# EAGLE design untitled (EAGLE 6.5.0)
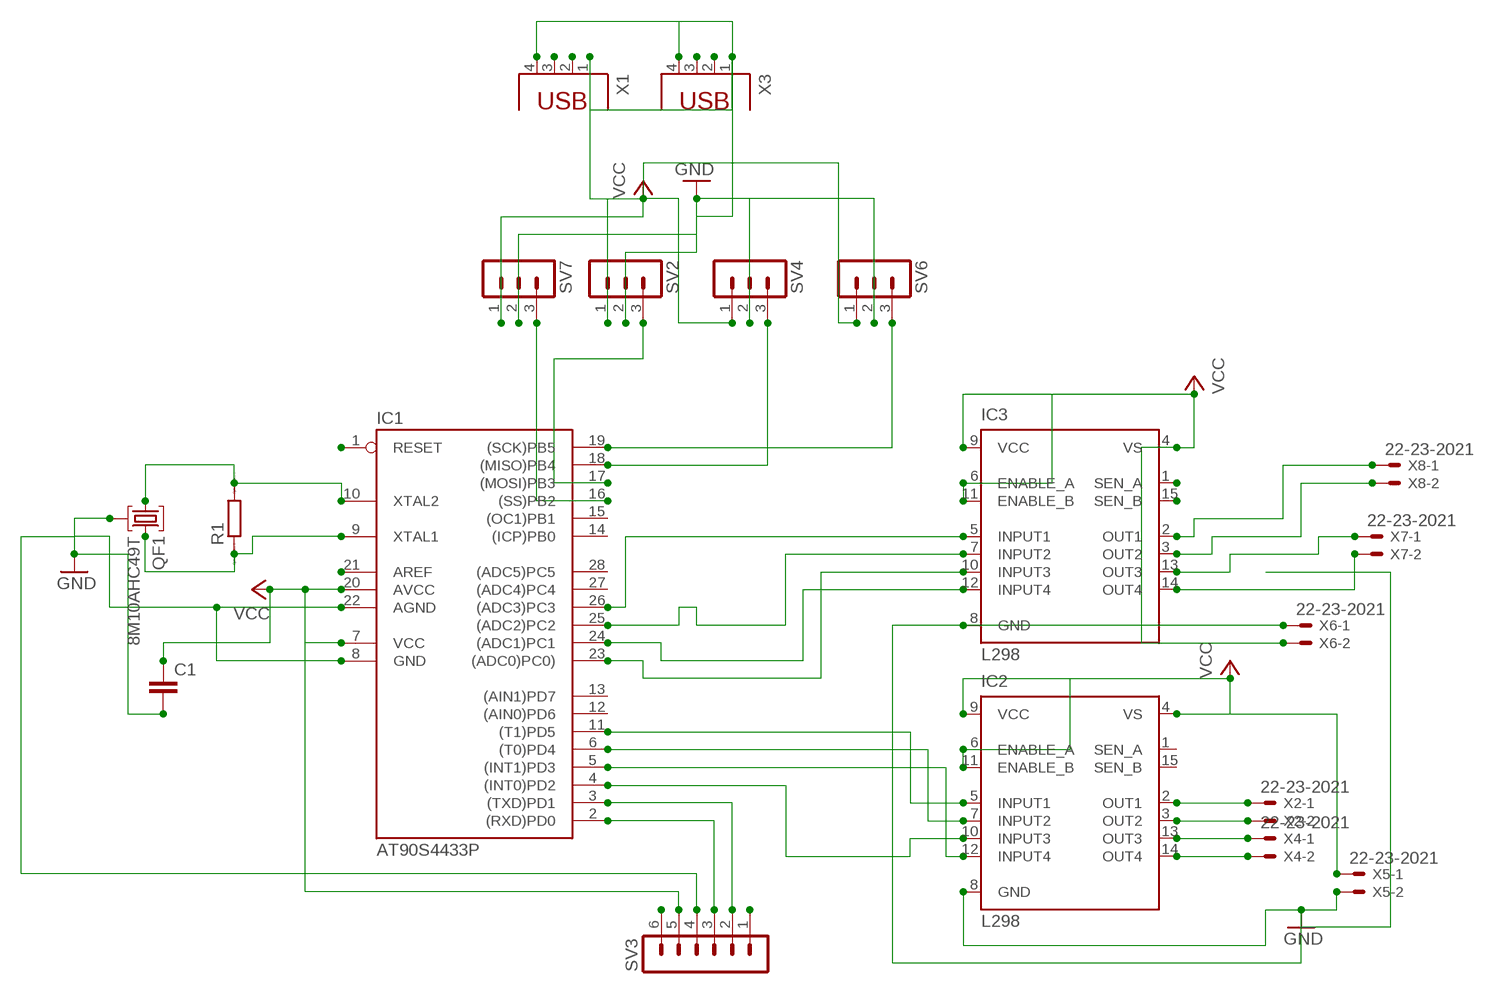
[diagram p0: schematic, sheet 1]

## Parts
C1  C2,5-3  [C2.5-3]
IC1  AT90S4433P  [DIL28-3]
IC2  L298  [MULTIWATT-15]
IC3  L298  [MULTIWATT-15]
QF1  8M10AHC49T  [HC49U]
R1  R0207/10  [0207/10]
SV2  MA03-1  [MA03-1]
SV3  MA06-1  [MA06-1]
SV4  MA03-1  [MA03-1]
SV6  MA03-1  [MA03-1]
SV7  MA03-1  [MA03-1]
X1  PN61729  [PN61729]
X2  22-23-2021  [22-23-2021]
X3  PN61729  [PN61729]
X4  22-23-2021  [22-23-2021]
X5  22-23-2021  [22-23-2021]
X6  22-23-2021  [22-23-2021]
X7  22-23-2021  [22-23-2021]
X8  22-23-2021  [22-23-2021]

## Nets
GND: C1.2 IC1.8(GND) IC1.22(AGND) IC2.8(GND) IC3.8(GND) QF1.2 SV2.2 SV3.4 SV4.2 SV6.2 SV7.2 X1.4 X3.4 X5.2 X6.1
N$1: IC1.10(XTAL2) QF1.1 R1.2
N$2: IC1.18((MISO)PB4) SV4.3
N$4: IC1.23((ADC0)PC0)) IC3.10(INPUT3)
N$5: IC1.1(RESET)
N$6: IC1.16((SS)PB2) SV7.3
N$7: IC1.9(XTAL1) QF1.3 R1.1
N$8: IC1.21(AREF)
N$9: IC1.17((MOSI)PB3) SV2.3
N$10: IC2.2(OUT1) X2.1
N$11: IC1.26((ADC3)PC3) IC3.5(INPUT1)
N$12: X1.2
N$13: IC1.19((SCK)PB5) SV6.3
N$14: X1.3
N$15: IC1.24((ADC1)PC1) IC3.12(INPUT4)
N$16: IC2.3(OUT2) X2.2
N$17: IC1.25((ADC2)PC2) IC3.7(INPUT2)
N$18: IC2.13(OUT3) X4.1
N$19: IC2.14(OUT4) X4.2
N$20: IC1.4((INT0)PD2) IC2.10(INPUT3)
N$27: IC1.11((T1)PD5) IC2.5(INPUT1)
N$28: IC1.6((T0)PD4) IC2.7(INPUT2)
N$29: IC1.5((INT1)PD3) IC2.12(INPUT4)
N$30: IC3.2(OUT1) X8.1
N$31: IC3.3(OUT2) X8.2
N$32: IC3.13(OUT3) X7.1
N$33: IC3.14(OUT4) X7.2
N$41: SV3.6
N$44: IC1.2((RXD)PD0) SV3.3
N$45: IC1.3((TXD)PD1) SV3.2
N$46: SV3.1
N$49: X3.3
N$50: X3.2
N$54: IC3.1(SEN_A)
N$55: IC3.15(SEN_B)
VCC: C1.1 IC1.7(VCC) IC1.20(AVCC) IC2.4(VS) IC2.6(ENABLE_A) IC2.9(VCC) IC2.11(ENABLE_B) IC3.4(VS) IC3.6(ENABLE_A) IC3.9(VCC) IC3.11(ENABLE_B) SV2.1 SV3.5 SV4.1 SV6.1 SV7.1 X1.1 X3.1 X5.1 X6.2
Unconnected: IC1.12((AIN0)PD6) IC1.13((AIN1)PD7) IC1.14((ICP)PB0) IC1.15((OC1)PB1) IC1.27((ADC4)PC4) IC1.28((ADC5)PC5) IC2.1(SEN_A) IC2.15(SEN_B)

## Library data of the parts
C1 = capacitor-wima:C: CAPACITOR naming: grid - package width
IC1 = atmel:AT90S4433: MICROCONTROLLER 4 Kbytes FLASH 128 bytes SRAM 256 bytes EEPROM UART 6-channel 10 bit ADC; OC_FARNELL: unknown; OC_NEWARK: unknown
IC2 IC3 = st-microelectronics:L298: DUAL FULL-BRIDGE DRIVER; MPN: L298N; OC_FARNELL: 1589425; OC_NEWARK: 32M1527
QF1 = crystal:8M10AHC49T: Monolithic Crystal Filters Source: www.vanlong.com; OC_FARNELL: unknown; OC_NEWARK: unknown
R1 = eagle-ltspice:R: RESISTOR, European symbol; SPICEMODEL: NONE; SPICEPREFIX: R
SV2 SV4 SV6 SV7 = con-lstb:MA03-1: PIN HEADER; OC_FARNELL: unknown; OC_NEWARK: unknown
SV3 = con-lstb:MA06-1: PIN HEADER; OC_FARNELL: unknown; OC_NEWARK: unknown
X1 X3 = con-berg:PN61729: BERG USB connector; OC_FARNELL: unknown; OC_NEWARK: unknown
X2 X4-X8 = con-molex:22-23-2021: .100" (2.54mm) Center Header - 2 Pin; MF: MOLEX; MPN: 22-23-2021; OC_FARNELL: 1462926; OC_NEWARK: 25C3832

## Board
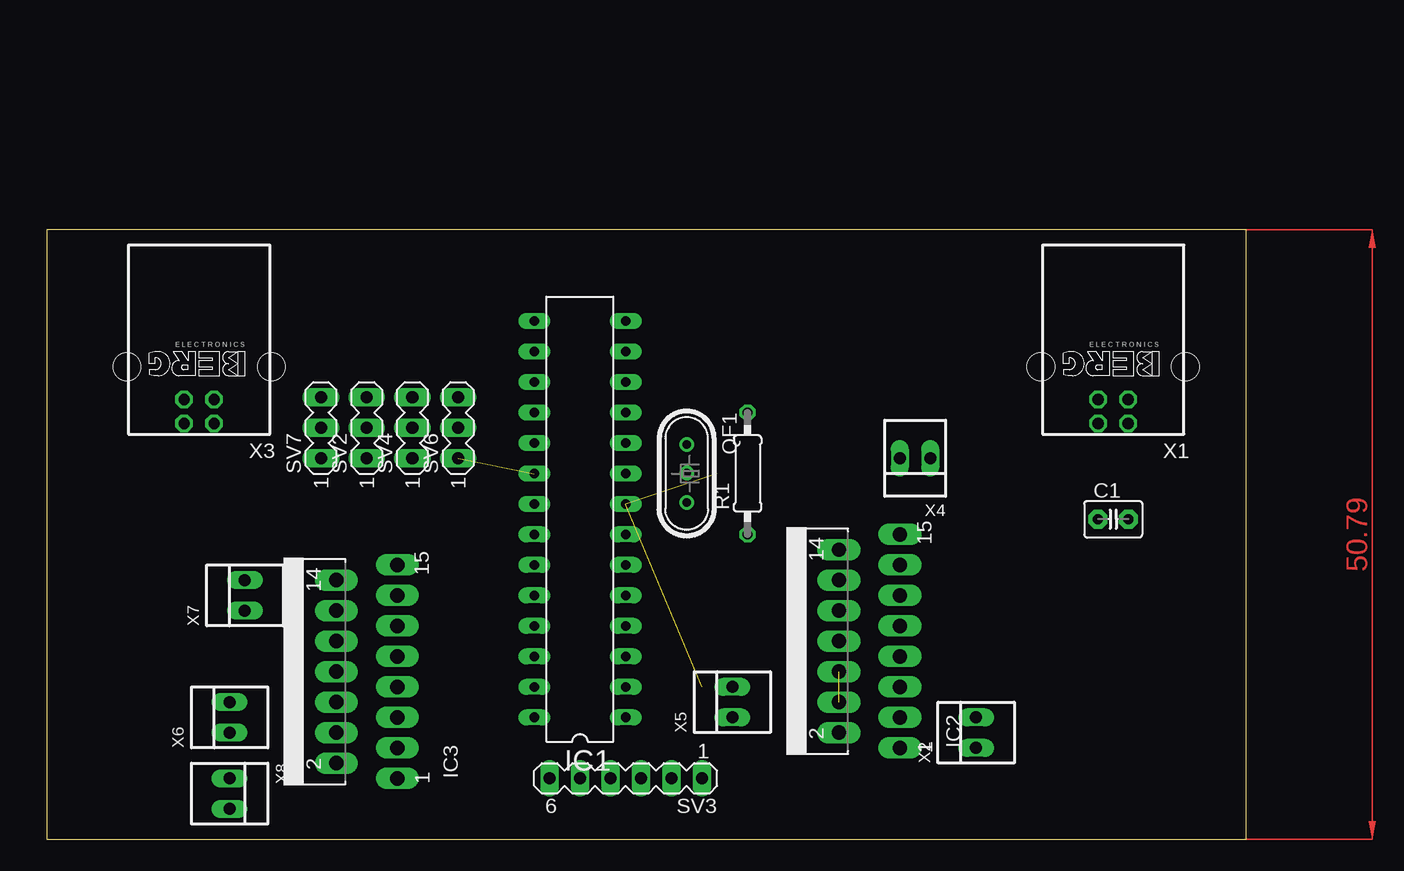
[diagram p1: board, top side]
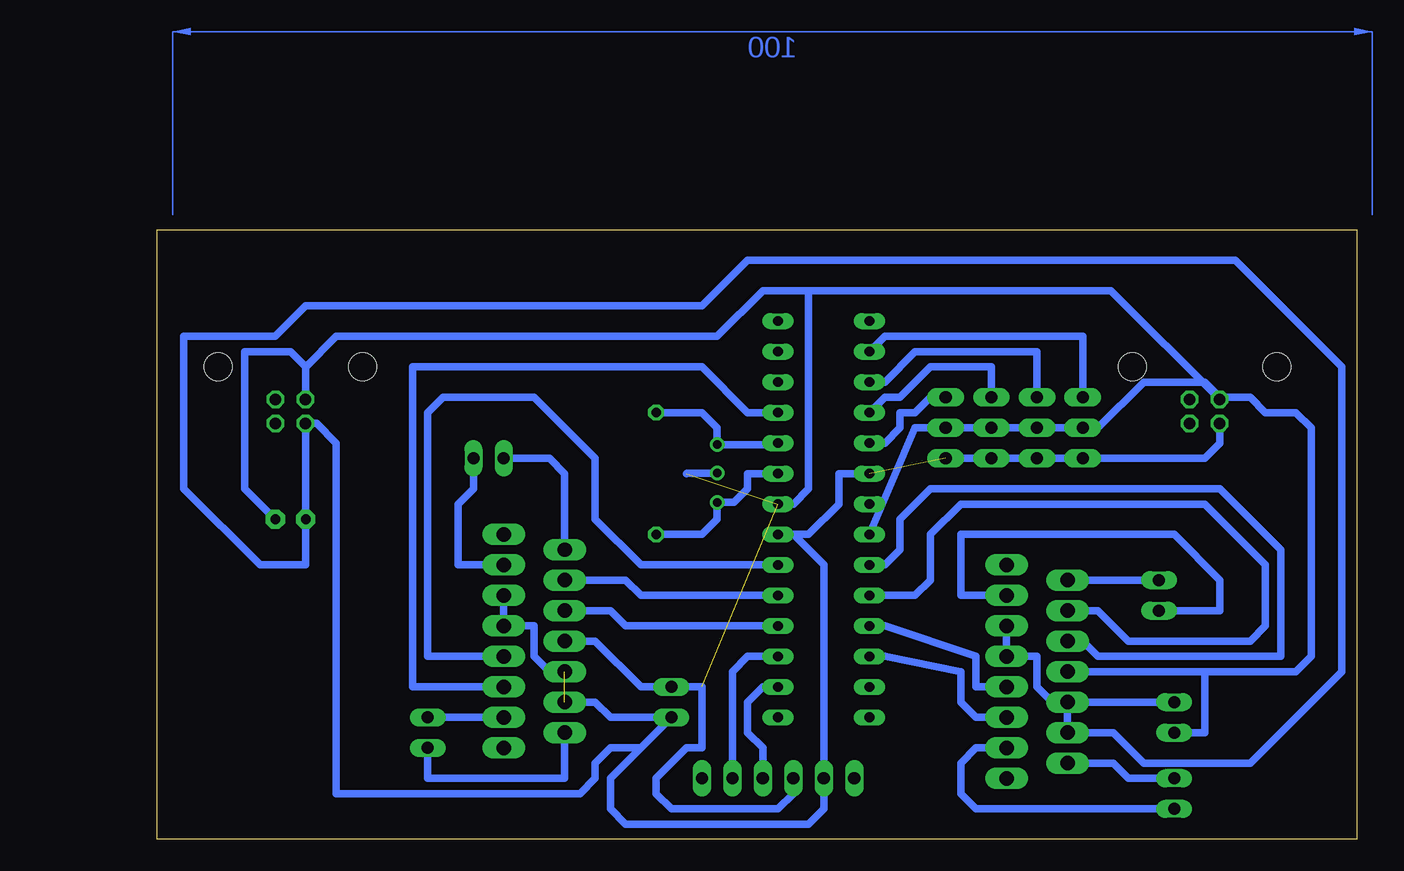
[diagram p2: board, bottom side, seen from below]

Size 100 x 50.79 mm. Coordinates in mm from the lower left corner, seen from the top.
Outline: 0,0 100,0 100,50.79 0,50.79 0,0
Copper layers (1*16): Top 0.035mm / dielectric 1.5mm / Bottom 0.035mm
Design rules "default": minimum track width 10mil, minimum drill 24mil, track to track 8mil, track to pad 8mil, pad to pad 8mil, via to via 8mil, smd to smd 8mil, copper to edge 40mil, drill to drill 8mil, minimum pad ring 10mil, minimum via ring 8mil, stop-mask expansion 4mil, vias tented up to drill 0mil, thermal gap 10mil

### Footprints (pad centres in the part's own frame; a part is rotated, then mirrored left to right if it is on the bottom)
C2.5-3 = drill 0.813 pad 1.6 octagon: 1 -1.27,0; 2 1.27,0
DIL28-3 = drill 0.813 long: 1 -16.51,-3.81; 2 -13.97,-3.81; 3 -11.43,-3.81; 4 -8.89,-3.81; 5 -6.35,-3.81; 6 -3.81,-3.81; 7 -1.27,-3.81; 8 1.27,-3.81; 9 3.81,-3.81; 10 6.35,-3.81; 11 8.89,-3.81; 12 11.43,-3.81; 13 13.97,-3.81; 14 16.51,-3.81; 15 16.51,3.81; 16 13.97,3.81; 17 11.43,3.81; 18 8.89,3.81; 19 6.35,3.81; 20 3.81,3.81; 21 1.27,3.81; 22 -1.27,3.81; 23 -3.81,3.81; 24 -6.35,3.81; 25 -8.89,3.81; 26 -11.43,3.81; 27 -13.97,3.81; 28 -16.51,3.81
MULTIWATT-15 = drill 1.2 long: 1 -8.89,-7.62; 2 -7.62,-2.54; 3 -6.35,-7.62; 4 -5.08,-2.54; 5 -3.81,-7.62; 6 -2.54,-2.54; 7 -1.27,-7.62; 8 0,-2.54; 9 1.27,-7.62; 10 2.54,-2.54; 11 3.81,-7.62; 12 5.08,-2.54; 13 6.35,-7.62; 14 7.62,-2.54; 15 8.89,-7.62
HC49U = drill 0.7 pad 1.2: 1 -2.413,0; 2 -0.027,0; 3 2.413,0
0207/10 = drill 0.813 octagon: 1 -5.08,0; 2 5.08,0
MA03-1 = drill 1.016 long: 1 -2.54,0; 2 0,0; 3 2.54,0
MA06-1 = drill 1.016 long: 1 -6.35,0; 2 -3.81,0; 3 -1.27,0; 4 1.27,0; 5 3.81,0; 6 6.35,0
PN61729 = drill 0.95 octagon: 1 1.25,4.71; 2 -1.25,4.71; 3 -1.25,2.71; 4 1.25,2.71 | hole 2.3: -6.02,0; 6.02,0
22-23-2021 = drill 1 long: 1 -1.27,0; 2 1.27,0

### Placement (x,y rotation side)
C1  88.9,26.67 0 top
IC1  44.45,26.67 90 top
IC2  63.5,16.51 90 top
IC3  21.59,13.97 90 top
QF1  53.34,30.48 270 top
R1  58.42,30.48 90 top
SV2  26.67,34.29 90 top
SV3  48.26,5.08 180 top
SV4  30.48,34.29 90 top
SV6  34.29,34.29 90 top
SV7  22.86,34.29 90 top
X1  88.9,39.37 180 top
X2  77.47,8.89 90 top
X3  12.7,39.37 180 top
X4  72.39,31.75 180 top
X5  57.15,11.43 90 top
X6  15.24,10.16 90 top
X7  16.51,20.32 90 top
X8  15.24,3.81 270 top

### Tracks (layer width: path | path; a pad name or v marks a point on that pad's centre or on a via)
GND  (2 unrouted)
  Bottom 0.61: IC1.22 36.83,34.29 SV6.2 SV4.2 SV2.2 SV7.2 21.59,34.29 17.78,38.1 12.7,38.1 11.45,36.85 X3.4 | IC2.8 63.5,16.51 59.69,12.7 X5.2 54.61,12.7 54.61,7.62 55.88,7.62 58.42,5.08 58.42,3.81 57.15,2.54 48.26,2.54 46.99,3.81 SV3.4 | 45.72,45.72 49.53,45.72 53.34,41.91 85.09,41.91 87.65,39.35 X1.4 87.65,39.39 88.9,40.64 92.71,40.64 92.71,29.21 C1.2 | 45.72,45.72 20.51,45.72 X3.4 | X6.1 12.7,8.89 12.7,13.97 IC3.8 5.08,13.97 3.81,15.24 3.81,34.29 5.08,35.56 7.62,35.56 8.89,36.83 11.28,36.83 X3.4 | IC1.8 46.99,27.94 45.72,29.21 45.72,45.72 | QF1.2 55.85,30.51 55.88,30.48
N$1
  Bottom 0.61: IC1.10 48.39,32.89 QF1.1 53.34,34.29 54.61,35.56 R1.2
N$2
  Bottom 0.61: SV4.3 30.48,39.37 35.56,39.37 38.1,36.83 39.37,36.83 IC1.18
N$4
  Bottom 0.61: IC1.23 39.37,22.86 38.1,24.13 38.1,26.67 35.56,29.21 11.43,29.21 6.35,24.13 6.35,15.24 21.59,15.24 22.86,16.51 IC3.10
N$6
  Bottom 0.61: SV7.3 22.86,41.91 39.37,41.91 IC1.16
N$7
  Bottom 0.61: IC1.9 50.8,30.48 50.8,29.21 51.94,28.07 QF1.3 53.34,26.67 54.61,25.4 R1.1
N$9
  Bottom 0.61: SV2.3 26.67,40.64 36.83,40.64 39.37,38.1 IC1.17
N$10
  Bottom 0.61: IC2.2 66.04,5.08 77.47,5.08 X2.1
N$11
  Bottom 0.61: IC3.5 31.75,10.16 33.02,11.43 33.02,13.97 39.37,15.24 IC1.26
N$13
  Bottom 0.61: SV6.3 35.56,36.83 36.83,35.56 38.1,35.56 38.1,34.29 39.37,33.02 IC1.19
N$15
  Bottom 0.61: IC1.24 36.83,20.32 35.56,21.59 35.56,25.4 33.02,27.94 12.7,27.94 7.62,22.86 7.62,17.78 8.89,16.51 19.05,16.51 21.59,19.05 IC3.12
N$16
  Bottom 0.61: IC2.3 X2.2
N$17
  Bottom 0.61: IC3.7 31.75,12.7 31.75,15.24 39.37,17.78 IC1.25
N$18
  Bottom 0.61: X4.1 73.66,29.21 74.93,27.94 74.93,22.86 IC2.13
N$19
  Bottom 0.61: IC2.14 66.04,30.48 67.31,31.75 X4.2
N$20
  Bottom 0.61: IC2.10 62.23,19.05 60.96,17.78 IC1.4
N$27
  Bottom 0.61: IC2.5 78.74,12.7 78.74,39.37 54.61,39.37 50.8,35.56 IC1.11
N$28
  Bottom 0.61: IC2.7 77.47,15.24 77.47,35.56 76.2,36.83 68.58,36.83 63.5,31.75 63.5,26.67 59.69,22.86 IC1.6
N$29
  Bottom 0.61: IC2.12 60.96,21.59 59.69,20.32 IC1.5
N$30
  Bottom 0.61: X8.1 19.05,5.08 20.32,6.35 IC3.2
N$31
  Bottom 0.61: IC3.3 31.75,7.62 33.02,6.35 33.02,3.81 31.75,2.54 X8.2
N$32
  Bottom 0.61: IC3.13 33.02,20.32 33.02,25.4 15.24,25.4 11.43,21.59 11.43,19.05 X7.1
N$33
  Bottom 0.61: IC3.14 X7.2
N$44
  Bottom 0.61: IC1.2 49.53,12.7 50.8,11.43 50.8,8.89 49.53,7.62 SV3.3
N$45
  Bottom 0.61: IC1.3 50.8,15.24 52.07,13.97 SV3.2
VCC  (2 unrouted)
  Bottom 0.61: SV6.1 SV4.1 SV2.1 SV7.1 12.7,31.75 11.45,33 X3.1 | IC2.6 67.31,13.97 68.58,15.24 68.58,17.78 IC2.9 IC2.11 | X5.1 62.23,10.16 63.5,11.43 IC2.4 | IC1.7 46.99,25.4 | 46.99,25.4 44.45,22.86 SV3.5 44.45,2.54 45.72,1.27 60.96,1.27 62.23,2.54 62.23,5.08 X5.1 | X5.1 59.69,7.62 62.23,7.62 63.5,6.35 63.5,5.08 64.77,3.81 85.09,3.81 85.09,33.02 86.73,34.66 X1.1 87.65,26.69 C1.1 87.63,22.86 91.44,22.86 97.79,29.21 97.79,41.91 90.17,41.91 87.63,44.45 54.61,44.45 50.8,48.26 10.16,48.26 1.27,39.37 1.27,13.97 8.89,6.35 17.78,6.35 20.32,8.89 IC3.4 IC3.6 | IC3.6 X6.2 | IC3.11 IC3.9 26.67,15.24 26.67,12.7 25.4,11.43 IC3.6 | 46.99,25.4 45.72,25.4 43.18,27.94 43.18,30.48 IC1.20
(copper drawn outside any net)
  shapes: Bottom area x1, Top area x1